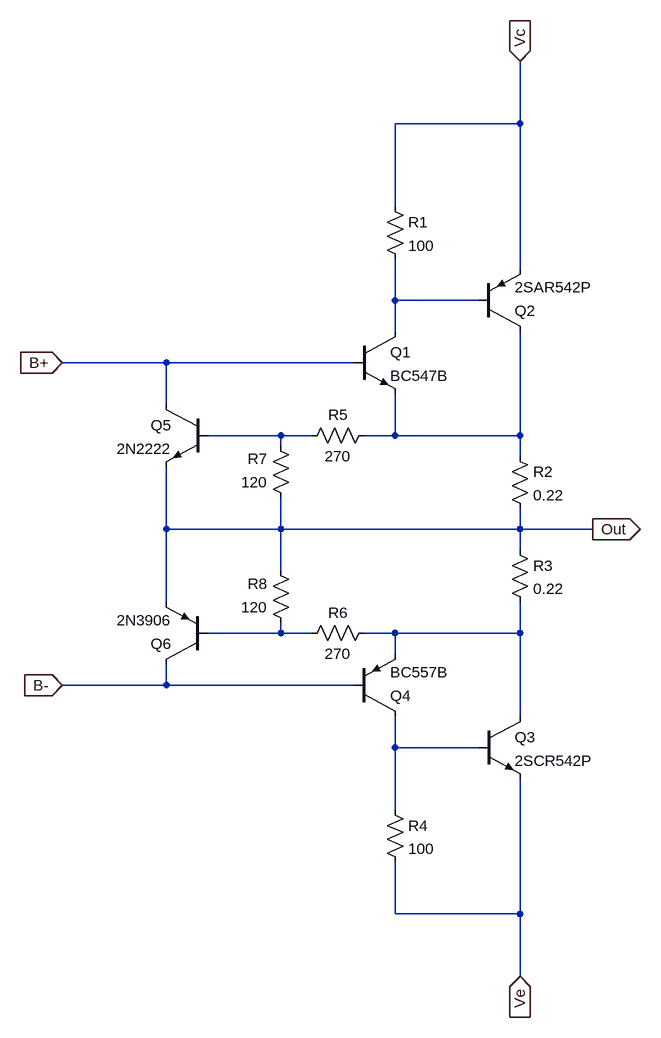
[diagram p0: schematic power_stage.asc]
power_stage.asc, the LTspice schematic file:
Version 4
SHEET 1 880 1352
WIRE 384 -48 384 -144
WIRE 384 -48 192 -48
WIRE 192 80 192 -48
WIRE 384 176 384 -48
WIRE 192 224 192 160
WIRE 320 224 192 224
WIRE 192 272 192 224
WIRE -160 320 -320 320
WIRE 128 320 -160 320
WIRE -160 384 -160 320
WIRE 16 432 -96 432
WIRE 64 432 16 432
WIRE 192 432 192 368
WIRE 192 432 144 432
WIRE 384 432 384 272
WIRE 384 432 192 432
WIRE 16 448 16 432
WIRE 384 464 384 432
WIRE -160 576 -160 480
WIRE 16 576 16 528
WIRE 16 576 -160 576
WIRE 384 576 384 544
WIRE 384 576 16 576
WIRE 496 576 384 576
WIRE 384 608 384 576
WIRE 16 640 16 576
WIRE -160 688 -160 576
WIRE 16 736 16 720
WIRE 16 736 -96 736
WIRE 64 736 16 736
WIRE 192 736 144 736
WIRE 384 736 384 688
WIRE 384 736 192 736
WIRE 192 768 192 736
WIRE -160 816 -160 784
WIRE -160 816 -320 816
WIRE 128 816 -160 816
WIRE 384 864 384 736
WIRE 192 912 192 864
WIRE 320 912 192 912
WIRE 192 1008 192 912
WIRE 192 1168 192 1088
WIRE 384 1168 384 960
WIRE 384 1168 192 1168
WIRE 384 1264 384 1168
FLAG 384 -144 Vc
IOPIN 384 -144 In
FLAG 384 1264 Ve
IOPIN 384 1264 In
FLAG -320 320 B+
IOPIN -320 320 In
FLAG -320 816 B-
IOPIN -320 816 In
FLAG 496 576 Out
IOPIN 496 576 Out
SYMBOL res 176 64 R0
SYMATTR InstName R1
SYMATTR Value 100
SYMBOL npn 128 272 R0
SYMATTR InstName Q1
SYMATTR Value BC547B
SYMBOL pnp 320 272 M180
SYMATTR InstName Q2
SYMATTR Value 2SAR542P
SYMBOL res 368 448 R0
SYMATTR InstName R2
SYMATTR Value 0.22
SYMBOL res 368 592 R0
SYMATTR InstName R3
SYMATTR Value 0.22
SYMBOL npn 320 864 R0
SYMATTR InstName Q3
SYMATTR Value 2SCR542P
SYMBOL pnp 128 864 M180
SYMATTR InstName Q4
SYMATTR Value BC557B
SYMBOL res 176 992 R0
SYMATTR InstName R4
SYMATTR Value 100
SYMBOL res 160 416 R90
WINDOW 0 0 56 VBottom 2
WINDOW 3 32 56 VTop 2
SYMATTR InstName R5
SYMATTR Value 270
SYMBOL res 160 720 R90
WINDOW 0 0 56 VBottom 2
WINDOW 3 32 56 VTop 2
SYMATTR InstName R6
SYMATTR Value 270
SYMBOL res 32 544 R180
WINDOW 0 36 76 Left 2
WINDOW 3 36 40 Left 2
SYMATTR InstName R7
SYMATTR Value 120
SYMBOL res 32 736 R180
WINDOW 0 36 76 Left 2
WINDOW 3 36 40 Left 2
SYMATTR InstName R8
SYMATTR Value 120
SYMBOL npn -96 384 M0
SYMATTR InstName Q5
SYMATTR Value 2N2222
SYMBOL pnp -96 784 R180
SYMATTR InstName Q6
SYMATTR Value 2N3906

The netlist it stands for:
* power_stage.asc
R1 Vc N001 100
Q1 N001 B+ N003 0 BC547B
Q2 N003 N001 Vc 0 2SAR542P
R2 N003 Out 0.22
R3 Out N005 0.22
Q3 N005 N006 Ve 0 2SCR542P
Q4 N006 B- N005 0 BC557B
R4 N006 Ve 100
R5 N003 N002 270
R6 N005 N004 270
R7 Out N002 120
R8 N004 Out 120
Q5 B+ N002 Out 0 2N2222
Q6 B- N004 Out 0 2N3906
.model NPN NPN
.model PNP PNP
.lib standard.bjt
.backanno
.end